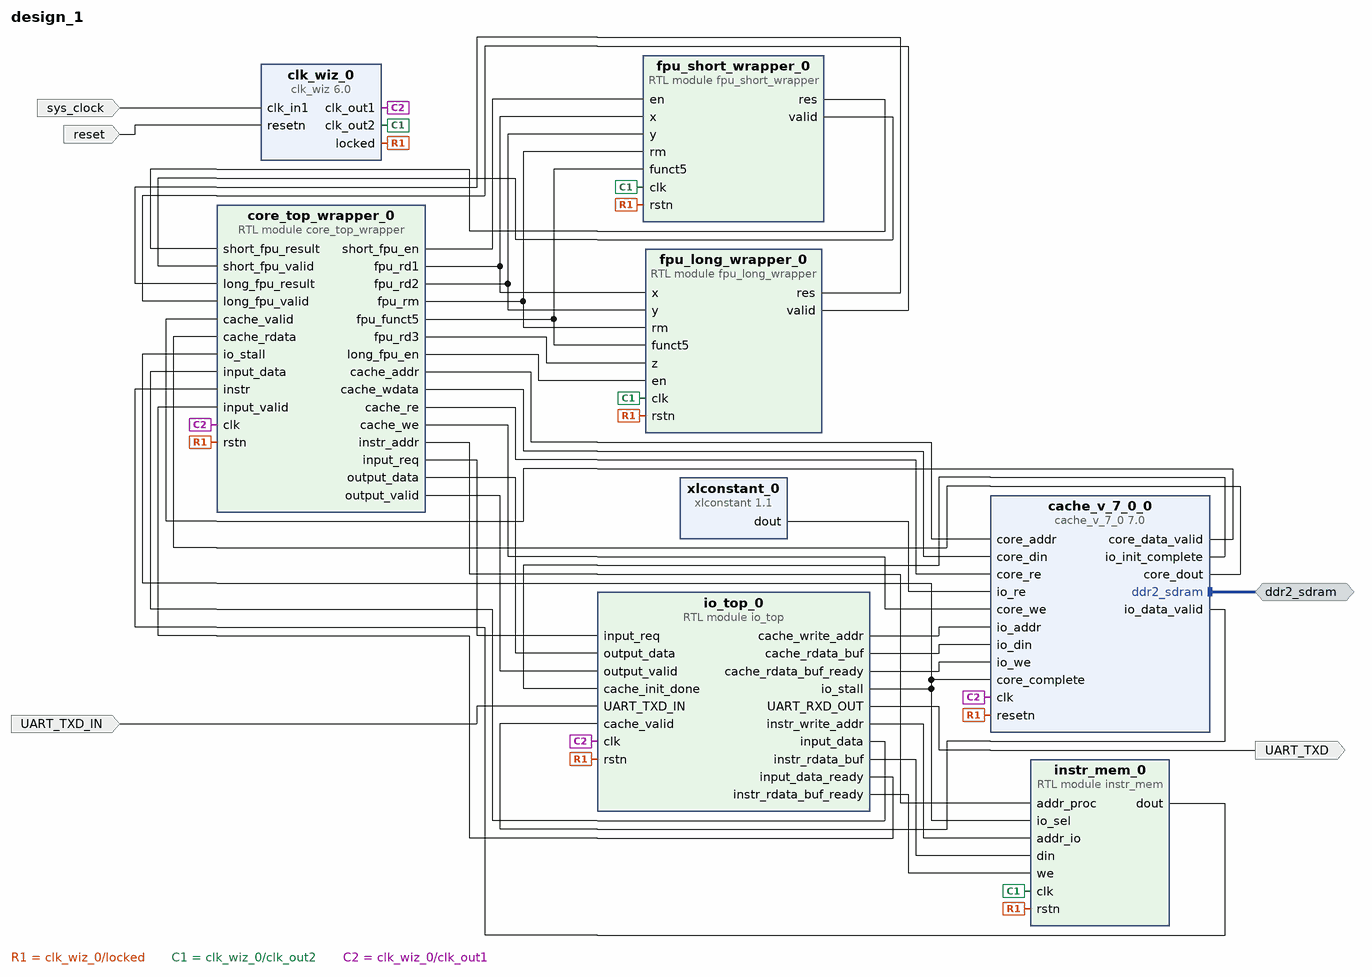
[diagram p0: block diagram of the top level]
# Vivado block design design_1, xc7a100tcsg324-1, Vivado 2020.2.2
create_bd_design design_1

create_bd_intf_port -mode Master -vlnv xilinx.com:interface:ddrx_rtl:1.0 ddr2_sdram
create_bd_port -dir I -type clk sys_clock
set_property -dict {CONFIG.FREQ_HZ 100000000 CONFIG.PHASE 0.000} [get_bd_ports sys_clock]
create_bd_port -dir I -type rst reset
set_property -dict {CONFIG.POLARITY ACTIVE_LOW} [get_bd_ports reset]
create_bd_port -dir O -type data UART_TXD
create_bd_port -dir I -type data UART_TXD_IN

create_bd_cell -type ip -vlnv xilinx.com:ip:clk_wiz:6.0 clk_wiz_0
set_property -dict [list \
  CONFIG.CLKOUT1_JITTER 137.392 \
  CONFIG.CLKOUT1_PHASE_ERROR 100.243 \
  CONFIG.CLKOUT1_REQUESTED_OUT_FREQ 80.2 \
  CONFIG.CLKOUT2_JITTER 137.392 \
  CONFIG.CLKOUT2_PHASE_ERROR 100.243 \
  CONFIG.CLKOUT2_REQUESTED_OUT_FREQ 80.2 \
  CONFIG.CLKOUT2_REQUESTED_PHASE 180 \
  CONFIG.CLKOUT2_USED true \
  CONFIG.CLK_IN1_BOARD_INTERFACE sys_clock \
  CONFIG.MMCM_CLKFBOUT_MULT_F 9.625 \
  CONFIG.MMCM_CLKOUT0_DIVIDE_F 12.000 \
  CONFIG.MMCM_CLKOUT1_DIVIDE 12 \
  CONFIG.MMCM_CLKOUT1_PHASE 180.000 \
  CONFIG.MMCM_DIVCLK_DIVIDE 1 \
  CONFIG.NUM_OUT_CLKS 2 \
  CONFIG.RESET_BOARD_INTERFACE reset \
  CONFIG.RESET_PORT resetn \
  CONFIG.RESET_TYPE ACTIVE_LOW \
  CONFIG.USE_BOARD_FLOW true \
] [get_bd_cells clk_wiz_0]
create_bd_cell -type ip -vlnv xilinx.com:ip:xlconstant:1.1 xlconstant_0
set_property -dict {CONFIG.CONST_VAL 0} [get_bd_cells xlconstant_0]
create_bd_cell -type ip -vlnv xilinx.com:user:cache_v_7_0:7.0 cache_v_7_0_0
create_bd_cell -type module -reference io_top io_top_0
create_bd_cell -type module -reference fpu_long_wrapper fpu_long_wrapper_0
create_bd_cell -type module -reference fpu_short_wrapper fpu_short_wrapper_0
create_bd_cell -type module -reference core_top_wrapper core_top_wrapper_0
create_bd_cell -type module -reference instr_mem instr_mem_0

# ---- connections ----

connect_bd_intf_net [get_bd_intf_ports ddr2_sdram] [get_bd_intf_pins cache_v_7_0_0/ddr2_sdram]
connect_bd_net [get_bd_ports sys_clock] [get_bd_pins clk_wiz_0/clk_in1]
connect_bd_net [get_bd_pins fpu_long_wrapper_0/res] [get_bd_pins core_top_wrapper_0/long_fpu_result]
connect_bd_net [get_bd_pins fpu_long_wrapper_0/valid] [get_bd_pins core_top_wrapper_0/long_fpu_valid]
connect_bd_net [get_bd_pins fpu_short_wrapper_0/res] [get_bd_pins core_top_wrapper_0/short_fpu_result]
connect_bd_net [get_bd_pins fpu_short_wrapper_0/valid] [get_bd_pins core_top_wrapper_0/short_fpu_valid]
connect_bd_net [get_bd_pins core_top_wrapper_0/fpu_rd1] [get_bd_pins fpu_long_wrapper_0/x] [get_bd_pins fpu_short_wrapper_0/x]
connect_bd_net [get_bd_pins core_top_wrapper_0/fpu_rd2] [get_bd_pins fpu_long_wrapper_0/y] [get_bd_pins fpu_short_wrapper_0/y]
connect_bd_net [get_bd_pins core_top_wrapper_0/fpu_rd3] [get_bd_pins fpu_long_wrapper_0/z]
connect_bd_net [get_bd_pins core_top_wrapper_0/fpu_rm] [get_bd_pins fpu_long_wrapper_0/rm] [get_bd_pins fpu_short_wrapper_0/rm]
connect_bd_net [get_bd_pins core_top_wrapper_0/fpu_funct5] [get_bd_pins fpu_long_wrapper_0/funct5] [get_bd_pins fpu_short_wrapper_0/funct5]
connect_bd_net [get_bd_pins core_top_wrapper_0/short_fpu_en] [get_bd_pins fpu_short_wrapper_0/en]
connect_bd_net [get_bd_pins core_top_wrapper_0/long_fpu_en] [get_bd_pins fpu_long_wrapper_0/en]
connect_bd_net [get_bd_pins core_top_wrapper_0/instr_addr] [get_bd_pins instr_mem_0/addr_proc]
connect_bd_net [get_bd_pins instr_mem_0/dout] [get_bd_pins core_top_wrapper_0/instr]
connect_bd_net [get_bd_pins io_top_0/instr_write_addr] [get_bd_pins instr_mem_0/addr_io]
connect_bd_net [get_bd_pins io_top_0/instr_rdata_buf] [get_bd_pins instr_mem_0/din]
connect_bd_net [get_bd_pins io_top_0/instr_rdata_buf_ready] [get_bd_pins instr_mem_0/we]
connect_bd_net [get_bd_pins io_top_0/io_stall] \
  [get_bd_pins cache_v_7_0_0/core_complete] [get_bd_pins core_top_wrapper_0/io_stall] [get_bd_pins instr_mem_0/io_sel]
connect_bd_net [get_bd_pins io_top_0/input_data] [get_bd_pins core_top_wrapper_0/input_data]
connect_bd_net [get_bd_pins io_top_0/input_data_ready] [get_bd_pins core_top_wrapper_0/input_valid]
connect_bd_net [get_bd_pins core_top_wrapper_0/input_req] [get_bd_pins io_top_0/input_req]
connect_bd_net [get_bd_pins core_top_wrapper_0/output_data] [get_bd_pins io_top_0/output_data]
connect_bd_net [get_bd_pins core_top_wrapper_0/output_valid] [get_bd_pins io_top_0/output_valid]
connect_bd_net [get_bd_pins io_top_0/UART_RXD_OUT] [get_bd_ports UART_TXD]
connect_bd_net [get_bd_ports UART_TXD_IN] [get_bd_pins io_top_0/UART_TXD_IN]
connect_bd_net [get_bd_ports reset] [get_bd_pins clk_wiz_0/resetn]
connect_bd_net [get_bd_pins clk_wiz_0/locked] \
  [get_bd_pins cache_v_7_0_0/resetn] [get_bd_pins io_top_0/rstn] [get_bd_pins fpu_long_wrapper_0/rstn] \
  [get_bd_pins fpu_short_wrapper_0/rstn] [get_bd_pins core_top_wrapper_0/rstn] [get_bd_pins instr_mem_0/rstn]
connect_bd_net [get_bd_pins core_top_wrapper_0/cache_addr] [get_bd_pins cache_v_7_0_0/core_addr]
connect_bd_net [get_bd_pins core_top_wrapper_0/cache_wdata] [get_bd_pins cache_v_7_0_0/core_din]
connect_bd_net [get_bd_pins core_top_wrapper_0/cache_re] [get_bd_pins cache_v_7_0_0/core_re]
connect_bd_net [get_bd_pins core_top_wrapper_0/cache_we] [get_bd_pins cache_v_7_0_0/core_we]
connect_bd_net [get_bd_pins io_top_0/cache_write_addr] [get_bd_pins cache_v_7_0_0/io_addr]
connect_bd_net [get_bd_pins io_top_0/cache_rdata_buf] [get_bd_pins cache_v_7_0_0/io_din]
connect_bd_net [get_bd_pins io_top_0/cache_rdata_buf_ready] [get_bd_pins cache_v_7_0_0/io_we]
connect_bd_net [get_bd_pins xlconstant_0/dout] [get_bd_pins cache_v_7_0_0/io_re]
connect_bd_net [get_bd_pins cache_v_7_0_0/io_init_complete] [get_bd_pins io_top_0/cache_init_done]
connect_bd_net [get_bd_pins cache_v_7_0_0/io_data_valid] [get_bd_pins io_top_0/cache_valid]
connect_bd_net [get_bd_pins cache_v_7_0_0/core_data_valid] [get_bd_pins core_top_wrapper_0/cache_valid]
connect_bd_net [get_bd_pins cache_v_7_0_0/core_dout] [get_bd_pins core_top_wrapper_0/cache_rdata]
connect_bd_net [get_bd_pins clk_wiz_0/clk_out2] \
  [get_bd_pins fpu_short_wrapper_0/clk] [get_bd_pins fpu_long_wrapper_0/clk] [get_bd_pins instr_mem_0/clk]
connect_bd_net [get_bd_pins clk_wiz_0/clk_out1] [get_bd_pins cache_v_7_0_0/clk] [get_bd_pins io_top_0/clk] [get_bd_pins core_top_wrapper_0/clk]

validate_bd_design
save_bd_design
